# Altium project Test_git.PrjPcb
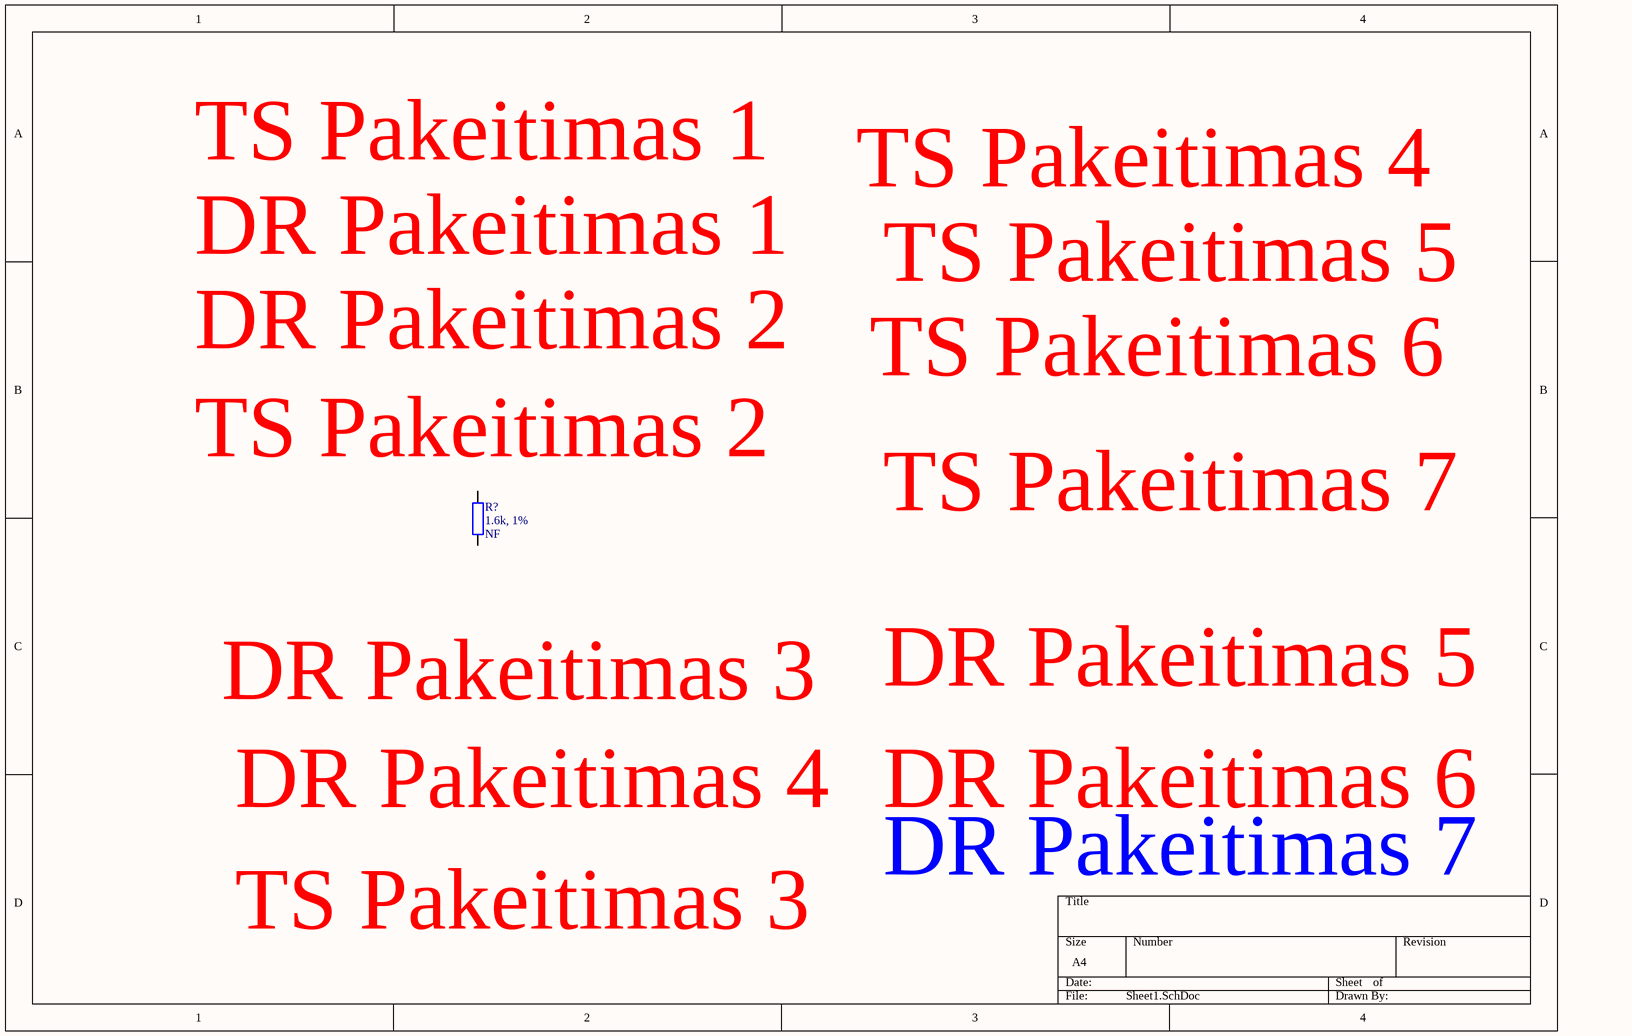
[diagram p0: Sheet1.SchDoc]
1 sheet, 1 parts. Net scope: global (net labels, ports and power ports of the same name join across sheets).
Board file: PCB1.PcbDoc

## Sheet Sheet1.SchDoc
size A4

### Parts
R?  1.6k, 1%  Assembly Info: NF  [RES0402]

### Nets

Not connected (* = marked no-connect by the designer): R? 1 2

### Notes on the sheet
- TS Pakeitimas 1
- TS Pakeitimas 4
- DR Pakeitimas 1
- TS Pakeitimas 5
- DR Pakeitimas 2
- TS Pakeitimas 6
- (near R?) TS Pakeitimas 2
- TS Pakeitimas 7
- DR Pakeitimas 3
- DR Pakeitimas 5
- DR Pakeitimas 4
- DR Pakeitimas 6
- DR Pakeitimas 7
- TS Pakeitimas 3

### Library data of the parts
R? = Res_0402: Manufacturer Part Number 1: RC0402FR-071K6L; Manufacturer: Yageo; Part Description: 1.6 kOhms ±1% 0.063W, 1/16W Chip Resistor 0402 (1005 Metric) Moisture Resistant Thick Film; Temperature Coefficient: ±100ppm/°C; Power (Watts): 0.063W, 1/16W; Value: 1.6k, 1%; Tolerance: ±1%; RoHS: RoHS Compliant; Package / Case: 0402 (1005 Metric); Height - Seated (Max): 0.016" (0.40mm); Supplier Device Package: 0402; Failure Rate: -; Composition: Thick Film; Part Status: Active; Size / Dimension: 0.039" L x 0.020" W (1.00mm x 0.50mm); Operating Temperature: -55°C ~ 155°C; Packaging: Cut Tape (CT); Features: Moisture Resistant; Supplier Part Number 1: YAG3045CT-ND; Category: Resistors; Supplier 1: Digi-Key